# EAGLE design rfid1 (EAGLE 6.0)
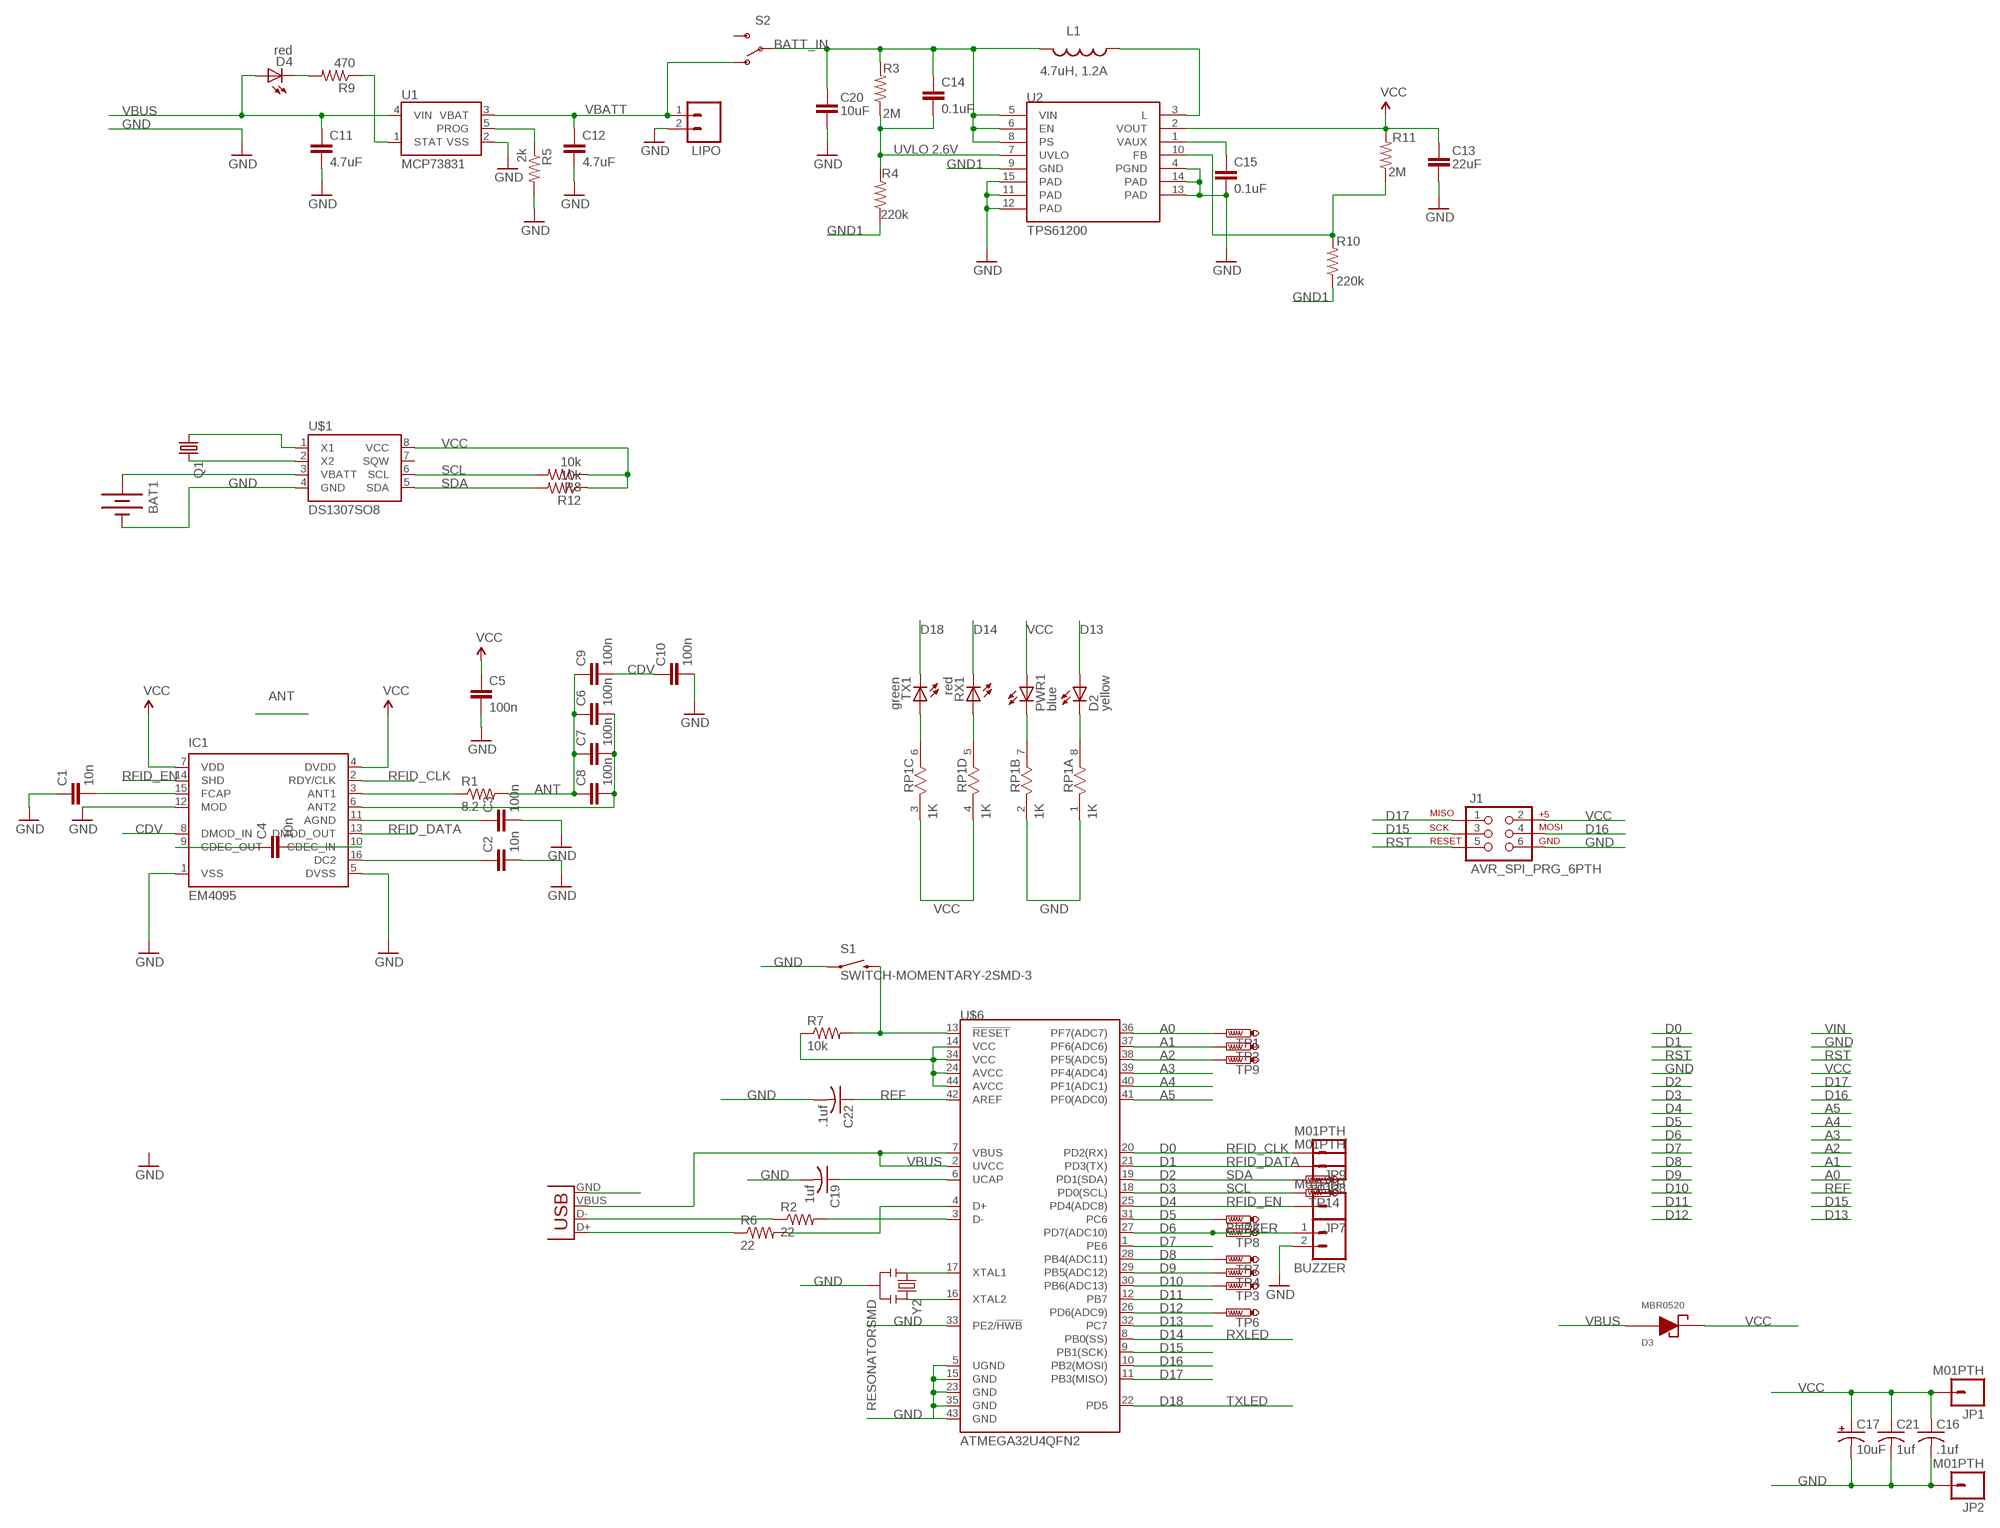
[diagram p0: schematic, sheet 1]

## Parts
BAT1  BATTERY12MM  [BATTCON_12MM]
BUZZER  M02PTH  [1X02]
C1  10n  CAP0805  [0805]
C2  10n  CAP0805  [0805]
C3  100n  CAP0805  [0805]
C4  10n  CAP0805  [0805]
C5  100n  CAP0805  [0805]
C6  100n  CAP0805  [0805]
C7  100n  CAP0805  [0805]
C8  100n  CAP0805  [0805]
C9  100n  CAP0805  [0805]
C10  100n  CAP0805  [0805]
C11  4.7uF  CAP0402-CAP  [0402-CAP]
C12  4.7uF  CAP0402-CAP  [0402-CAP]
C13  22uF  CAP0805  [0805]
C14  0.1uF  CAP0402-CAP  [0402-CAP]
C15  0.1uF  CAP0402-CAP  [0402-CAP]
C16  .1uf  C-USC0603  [C0603]
C17  10uF  CAP_POL1206  [EIA3216]
C19  1uf  C-USC0603  [C0603]
C20  10uF  CAP1206  [1206]
C21  1uf  C-USC0603  [C0603]
C22  .1uf  C-USC0603  [C0603]
D2  yellow  LEDCHIPLED_0805  [CHIPLED_0805]
D3  MBR0520  [SOD-123]
D4  red  LED0603  [LED-0603]
IC1  EM4095  [SO16]
J1  AVR_SPI_PRG_6PTH  [2X3]
JP1  M01PTH  [1X01]
JP2  M01PTH  [1X01]
JP7  M01PTH  [1X01]
JP8  M01PTH  [1X01]
JP9  M01PTH  [1X01]
L1  4.7uH, 1.2A  INDUCTOR.  [CDRH2D09]
LIPO  M02PTH  [1X02]
PWR1  blue  LEDCHIPLED_0805  [CHIPLED_0805]
Q1  CRYSTALTC26H  [TC26H]
R1  8.2  RESISTOR0805-RES  [0805]
R2  22  RESISTOR0603-RES  [0603-RES]
R3  2M  RESISTOR0402-RES  [0402-RES]
R4  220k  RESISTOR0402-RES  [0402-RES]
R5  2k  RESISTOR0402-RES  [0402-RES]
R6  22  RESISTOR0603-RES  [0603-RES]
R7  10k  RESISTOR0603-RES  [0603-RES]
R8  10k  RESISTOR0603-RES  [0603-RES]
R9  470  RESISTOR0402-RES  [0402-RES]
R10  220k  RESISTOR0402-RES  [0402-RES]
R11  2M  RESISTOR0402-RES  [0402-RES]
R12  10k  RESISTOR0603-RES  [0603-RES]
RP1  1K  RES4NT  [RES4NT]
RX1  red  LEDCHIPLED_0805  [CHIPLED_0805]
S1  SWITCH-MOMENTARY-2SMD-3  [TACTILE_SWITCH_SMD-3]
S2  SWITCH-SPDTPTH  [SWITCH-SPDT]
TP1  PTR1TP15R  [TP15R]
TP2  PTR1TP15R  [TP15R]
TP3  PTR1TP15R  [TP15R]
TP4  PTR1TP15R  [TP15R]
TP5  PTR1TP15R  [TP15R]
TP6  PTR1TP15R  [TP15R]
TP7  PTR1TP15R  [TP15R]
TP8  PTR1TP15R  [TP15R]
TP9  PTR1TP15R  [TP15R]
TP13  PTR1TP15R  [TP15R]
TP14  PTR1TP15R  [TP15R]
TX1  green  LEDCHIPLED_0805  [CHIPLED_0805]
U1  MCP73831  [SOT23-5]
U2  TPS61200  [QFN-10_PAD]
U$1  DS1307SO8  [SO08]
U$6  ATMEGA32U4QFN2  [QFN-44-NOPAD]
X2  USB-MICROB  [USB-MICROB]
Y2  RESONATORSMD  [RESONATOR-SMD]

## Nets
A0: TP1.TP U$6.36(PF7(ADC7))
A1: TP2.TP U$6.37(PF6(ADC6))
A2: TP9.TP U$6.38(PF5(ADC5))
A3: U$6.39(PF4(ADC4))
A4: U$6.40(PF1(ADC1))
A5: U$6.41(PF0(ADC0))
ANT: C6.1 C7.1 C8.1 C9.1 R1.2
BATT_IN: C14.1 C20.1 L1.P$2 R3.2 S2.2(P) U2.5(VIN) U2.6(EN) U2.8(PS)
CDV: C9.2 C10.1 IC1.8(DMOD_IN)
D5: TP5.TP U$6.31(PC6)
D6: BUZZER.1 TP8.TP U$6.27(PD7(ADC10))
D7: U$6.1(PE6)
D8: TP7.TP U$6.28(PB4(ADC11))
D9: TP4.TP U$6.29(PB5(ADC12))
D10: TP3.TP U$6.30(PB6(ADC13))
D11: U$6.12(PB7)
D12: TP6.TP U$6.26(PD6(ADC9))
D13: D2.A U$6.32(PC7)
D14: RX1.C U$6.8(PB0(SS))
D15: J1.3 U$6.9(PB1(SCK))
D16: J1.4 U$6.10(PB2(MOSI))
D17: J1.1 U$6.11(PB3(MISO))
D18: TX1.C U$6.22(PD5)
FB: R10.2 R11.1 U2.10(FB)
GND: BAT1.GND(-) BUZZER.2 C1.1 C2.2 C3.2 C5.2 C10.2 C11.2 C12.2 C13.2 C15.2 C16.2 C17.C(-) C19.2 C20.2 C21.2 C22.2 IC1.1(VSS) IC1.5(DVSS) IC1.12(MOD) J1.6 JP2.1 LIPO.2 R5.2 RP1.1 RP1.2 S1.P$1 U1.2(VSS) U2.4(PGND) U2.11(PAD) U2.12(PAD) U2.13(PAD) U2.14(PAD) U2.15(PAD) U$1.4(GND) U$6.5(UGND) U$6.15(GND) U$6.23(GND) U$6.33(PE2/!HWB) U$6.35(GND) U$6.43(GND) X2.GND Y2.2
GND1: R4.1 R10.1 U2.9(GND)
N$1: IC1.3(ANT1) R1.1
N$2: D4.C R9.2
N$3: U$6.16(XTAL2) Y2.3
N$4: C6.2 C7.2 C8.2 IC1.6(ANT2)
N$5: L1.P$1 U2.3(L)
N$6: C3.1 IC1.11(AGND)
N$7: C4.2 IC1.10(CDEC_IN)
N$8: C4.1 IC1.9(CDEC_OUT)
N$9: C15.1 U2.1(VAUX)
N$11: R5.1 U1.5(PROG)
N$12: C2.1 IC1.16(DC2)
N$14: R9.1 U1.1(STAT)
N$15: C1.2 IC1.15(FCAP)
N$17: Q1.1 U$1.1(X1)
N$18: U$6.17(XTAL1) Y2.1
N$19: Q1.2 U$1.2(X2)
N$20: BAT1.PWR@1(+) U$1.3(VBATT)
N$22: R6.2 U$6.4(D+)
N$23: R2.2 U$6.3(D-)
N$24: C19.1 U$6.6(UCAP)
N$25: R2.1 X2.D-
N$26: R6.1 X2.D+
N$28: RP1.6 TX1.A
N$29: RP1.5 RX1.A
N$30: PWR1.C RP1.7
N$31: D2.C RP1.8
REF: C22.1 U$6.42(AREF)
RFID_CLK: IC1.2(RDY/CLK) JP9.1 U$6.20(PD2(RX))
RFID_DATA: IC1.13(DMOD_OUT) JP8.1 U$6.21(PD3(TX))
RFID_EN: IC1.14(SHD) JP7.1 U$6.25(PD4(ADC8))
RST: J1.5 R7.2 S1.P$2 U$6.13(!RESET)
SCL: R8.2 TP14.TP U$1.6(SCL) U$6.18(PD0(SCL))
SDA: R12.2 TP13.TP U$1.5(SDA) U$6.19(PD1(SDA))
UVLO: C14.2 R3.1 R4.2 U2.7(UVLO)
VBATT: C12.1 LIPO.1 S2.1(O) U1.3(VBAT)
VBUS: C11.1 D3.2(AN) D4.A U1.4(VIN) U$6.2(UVCC) U$6.7(VBUS) X2.VBUS
VCC: C5.1 C13.1 C16.1 C17.A(+) C21.1 D3.1(CA) IC1.4(DVDD) IC1.7(VDD) J1.2 JP1.1 PWR1.A R7.1 R8.1 R11.2 R12.1 RP1.3 RP1.4 U2.2(VOUT) U$1.8(VCC) U$6.14(VCC) U$6.24(AVCC) U$6.34(VCC) U$6.44(AVCC)
Unconnected: S2.3(S) U$1.7(SQW)

## Notes on the sheet
- UVLO 2.6V
- D0
- D1
- D2
- D3
- D4
- BUZZER
- RXLED
- TXLED

## Library data of the parts
BAT1 = SparkFun-Electromechanical:BATTERY: Battery Holders Various common sizes : AA, AAA, 20mm coin cell and 12mm coin cell.
BUZZER LIPO = SparkFun-Connectors:M02: Header 2 Standard 2-pin 0.1" header. Use with straight break away headers (SKU : PRT-00116), right angle break away headers (PRT-00553), swiss pins (PRT-00743), machine pins (PRT-00117), and female headers (PRT-00115). Molex polarized connector foot print use with SKU : PRT-08233 with associated crimp pins and housings.
C1-C10 = SparkFun-Passives:CAP: Capacitor Standard 0603 ceramic capacitor, and 0.1" leaded capacitor.
C11 C12 C14 C15 = SparkFun:CAP: Capacitor Standard 0603 ceramic capacitor, and 0.1" leaded capacitor.
C13 C20 = CH_passive:CAP: Capacitor Standard 0603 ceramic capacitor, and 0.1" leaded capacitor.
C16 C19 C21 C22 = resistor:C-US: CAPACITOR, American symbol
C17 = SparkFun:CAP_POL: Capacitor Polarized These are standard SMD and PTH capacitors. Normally 10uF, 47uF, and 100uF in electrolytic and tantalum varieties. Always verify the external diameter of the through hole cap, it varies with capacity, voltage, and manufacturer. The EIA devices should be standard.
D2 PWR1 RX1 TX1 = led:LED: LED OSRAM: - CHIPLED LG R971, LG N971, LY N971, LG Q971, LY Q971, LO R971, LY R971 LH N974, LH R974 LS Q976, LO Q976, LY Q976 LO Q996 - Hyper CHIPLED LW Q18S LB Q993, LB Q99A, LB R99A - SideLED LS A670, LO A670, LY A670, LG A670, LP A670 LB A673, LV A673, LT A673, LW A673 LH A674 LY A675 LS A676, LA A676, LO A676, LY A676, LW A676 LS A679, LY A679, LG A679 - Hyper Micro SIDELED® LS Y876, LA Y876, LO Y876, LY Y876 LT Y87S - SmartLED LW L88C, LW L88S LB L89C, LB L89S, LG L890 LS L89K, LO L89K, LY L89K LS L896, LA L896, LO L896, LY L896 - TOPLED LS T670, LO T670, LY T670, LG T670, LP T670 LSG T670, LSP T670, LSY T670, LOP T670, LYG T670 LG T671, LOG T671, LSG T671 LB T673, LV T673, LT T673, LW T673 LH T674 LS T676, LA T676, LO T676, LY T676, LB T676, LH T676, LSB T676, LW T676 LB T67C, LV T67C, LT T67C, LS T67K, LO T67K, LY T67K, LW E67C LS E67B, LA E67B, LO E67B, LY E67B, LB E67C, LV E67C, LT E67C LW T67C LS T679, LY T679, LG T679 LS T770, LO T770, LY T770, LG T770, LP T770 LB T773, LV T773, LT T773, LW T773 LH T774 LS E675, LA E675, LY E675, LS T675 LS T776, LA T776, LO T776, LY T776, LB T776 LHGB T686 LT T68C, LB T68C - Hyper Mini TOPLED® LB M676 - Mini TOPLED Santana® LG M470 LS M47K, LO M47K, LY M47K Source: http://www.osram.convergy.de LUXEON: - LUMILED® LXK2-PW12-R00, LXK2-PW12-S00, LXK2-PW14-U00, LXK2-PW14-V00 LXK2-PM12-R00, LXK2-PM12-S00, LXK2-PM14-U00 LXK2-PE12-Q00, LXK2-PE12-R00, LXK2-PE12-S00, LXK2-PE14-T00, LXK2-PE14-U00 LXK2-PB12-K00, LXK2-PB12-L00, LXK2-PB12-M00, LXK2-PB14-N00, LXK2-PB14-P00, LXK2-PB14-Q00 LXK2-PR12-L00, LXK2-PR12-M00, LXK2-PR14-Q00, LXK2-PR14-R00 LXK2-PD12-Q00, LXK2-PD12-R00, LXK2-PD12-S00 LXK2-PH12-R00, LXK2-PH12-S00 LXK2-PL12-P00, LXK2-PL12-Q00, LXK2-PL12-R00 Source: www.luxeon.com KINGBRIGHT: KA-3528ASYC Source: www.kingbright.com
D3 = MySMD:MBR0520
D4 = SparkFun:LED: LEDs Standard schematic elements and footprints for 5mm, 3mm, 1206, and 0603 sized LEDs. 5mm - Spark Fun Electronics SKU : COM-00529 (and others)
IC1 = em-microelectronic:EM4095: Read/Write analog front end for 125kHz RFID Basestation Source: http://www.emmicroelectronic.com/webfiles/Product/RFID/DS/EM4095_DS.pdf
J1 = SparkFun-Connectors:AVR_SPI_PRG_6: AVR ISP 6 Pin This is the reduced ISP connector for AVR programming. Common on Arduino. This footprint will take up less PCB space and can be used with a 10-pin to 6-pin adapter such as SKU: BOB-08508
JP1 JP2 JP7-JP9 = SparkFun-Connectors:M01: Header 1 Standard 1-pin 0.1" header. Use with straight break away headers (SKU : PRT-00116), right angle break away headers (PRT-00553), swiss pins (PRT-00743), machine pins (PRT-00117), and female headers (PRT-00115).
L1 = SparkFun:INDUCTOR: Inductors Basic Inductor/Choke - 0603 and 1206. Footprints are not proven and vary greatly between part numbers.
Q1 = crystal:CRYSTAL: CRYSTAL; OC_FARNELL: unknown; OC_NEWARK: unknown
R1 = SparkFun-Passives:RESISTOR: Resistor Basic schematic elements and footprints for 0603, 1206, and PTH resistors.
R2-R12 = SparkFun:RESISTOR: Resistor Basic schematic elements and footprints for 0603, 1206, and PTH resistors.
RP1 = MySMD:RES4NT
S1 = SparkFun:SWITCH-MOMENTARY-2
S2 = SparkFun-Electromechanical:SWITCH-SPDT: SPST Switch Simple slide switch. Spark Fun Electronics SKU : COM-00102
TP1-TP9 TP13 TP14 = testpad:PTR1: TEST PIN
U1 = SparkFun:MCP73831: Microchip's MCP73831 Miniature single cell, fully integrated Li-Ion, Li-polymer charge management controller http://ww1.microchip.com/downloads/en/DeviceDoc/21984a.pdf
U2 = SparkFun:TPS61200: DC to DC Booster
U$1 = SparkFun-FreqCtrl:DS1307: I2C real-time clock with battery backup.
U$6 = SparkFun-DigitalIC:ATMEGA32U4: Atmel 44-pin 8-bit Microcontroller with 32KBytes of ISP Flash and USB Controller
X2 = SparkFun:USB: USB Connectors USB-B-PTH is fully proven SKU : PRT-00139 USB-miniB is fully proven SKU : PRT-00587 USB-A-PCB is untested. USB-A-H is throughly reviewed, but untested. Spark Fun Electronics SKU : PRT-00437 USB-B-SMT is throughly reviewed, but untested. Needs silkscreen touching up. USB-A-S has not been used/tested USB-MB-H has not been used/tested
Y2 = SparkFun:RESONATOR: Resonator Small SMD resonator. This is the itty bitty 10/20MHz resonators with built in caps. CSTCE10M0G55 and CSTCE20M0V53. Footprint has been reviewed closely but hasn't been tested yet.

## Board
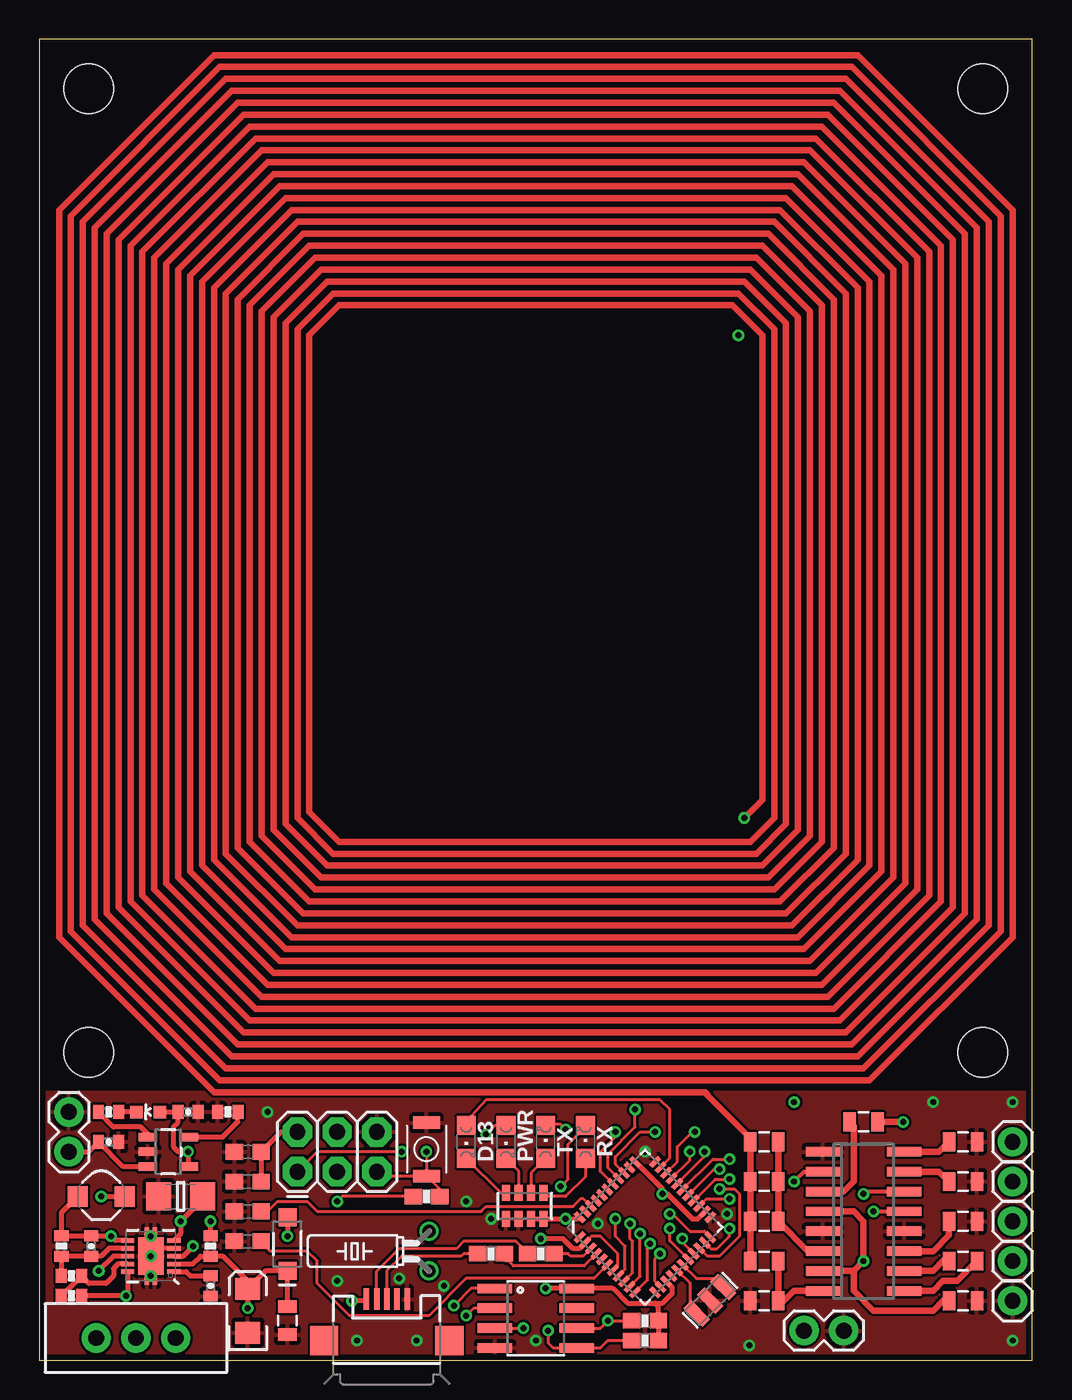
[diagram p1: board, top side]
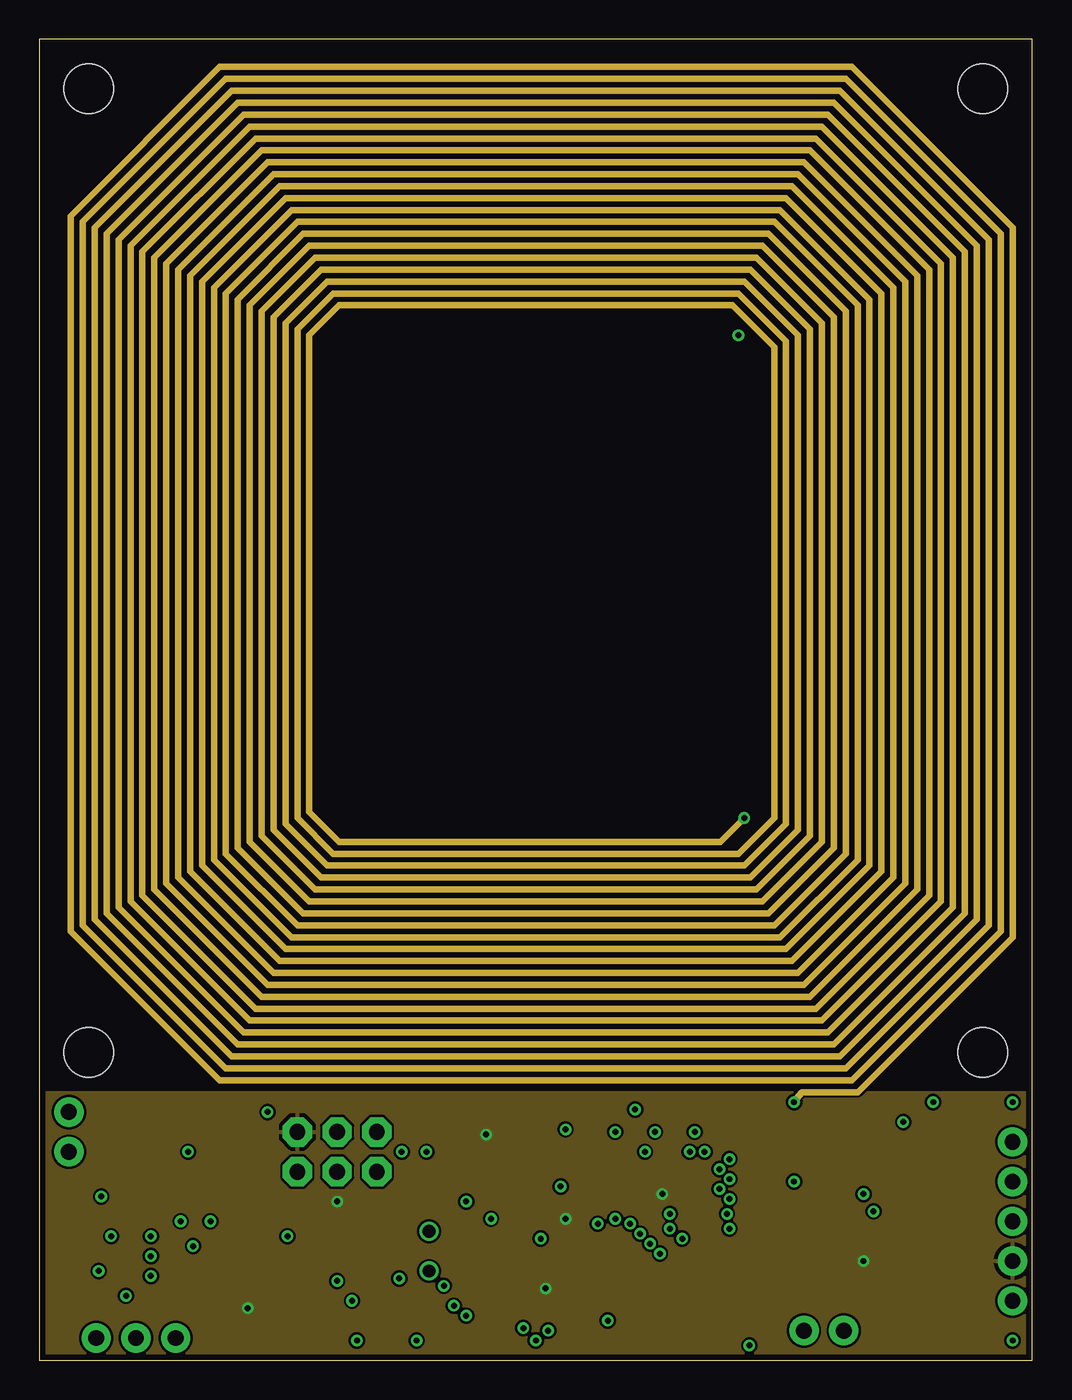
[diagram p2: board, inner layer Route2]
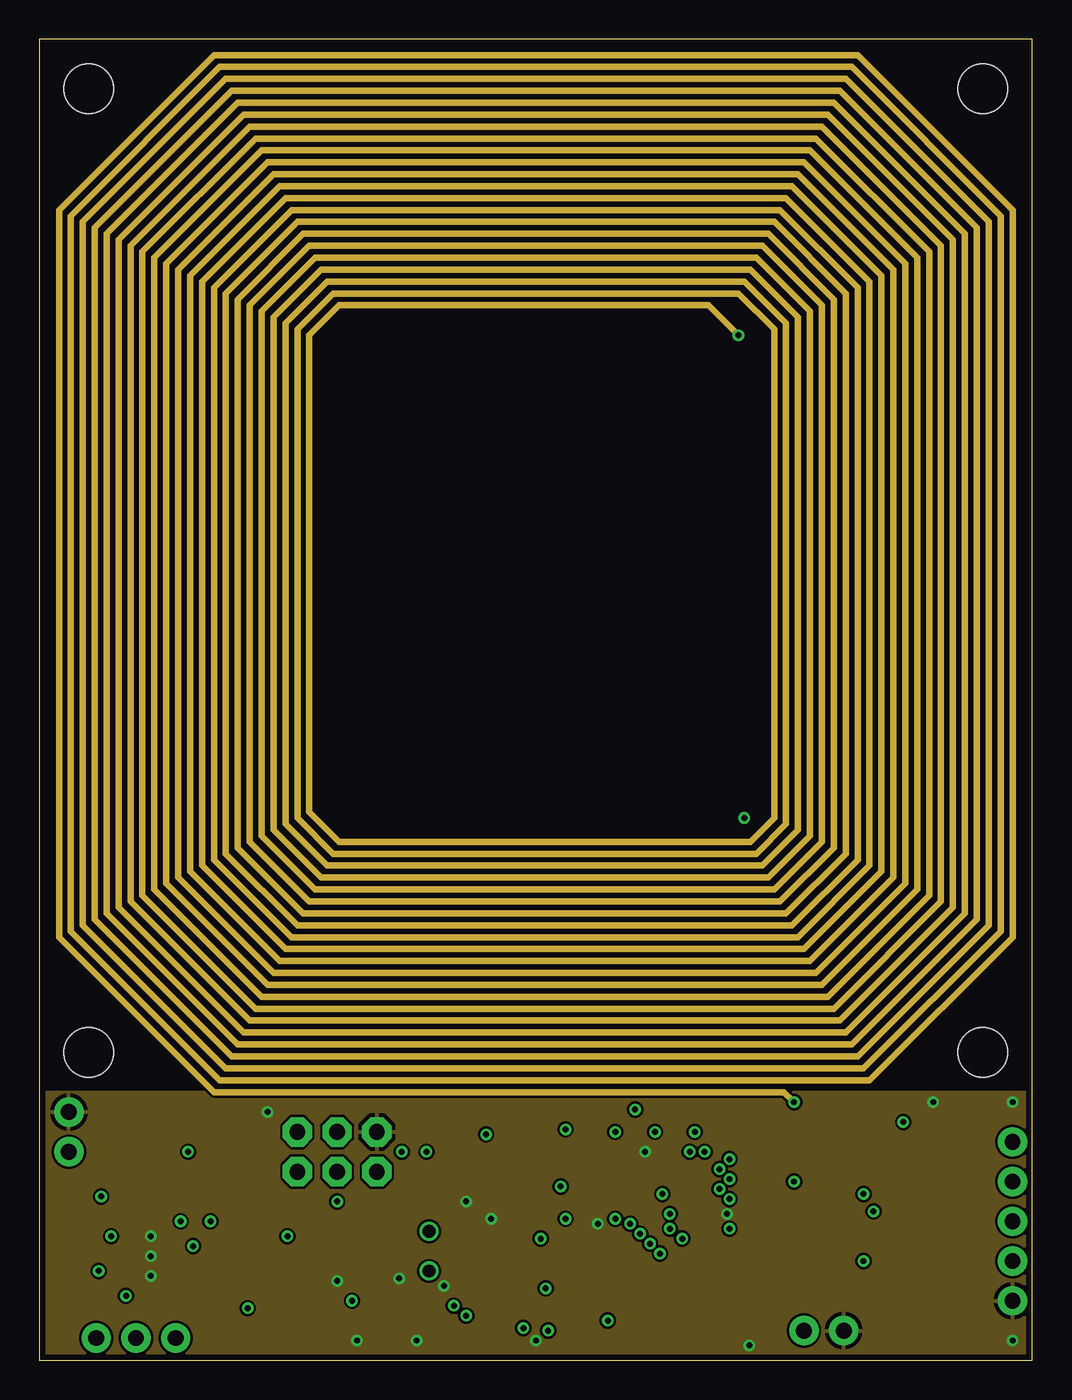
[diagram p3: board, inner layer Route15]
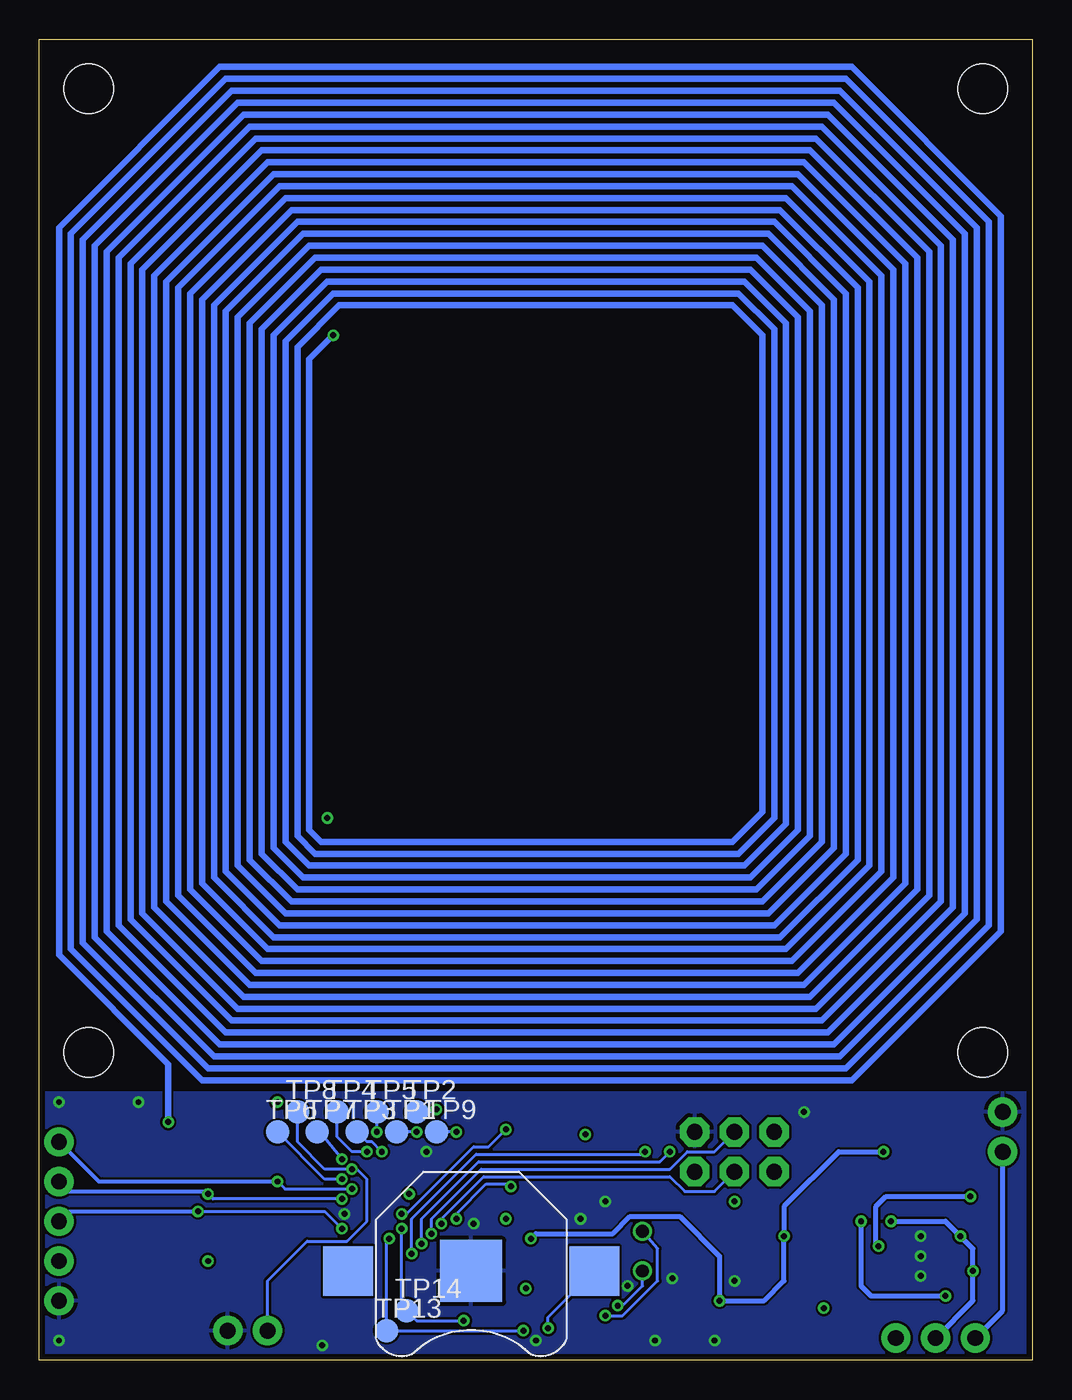
[diagram p4: board, bottom side, seen from below]

Size 63.5 x 84.45 mm. Coordinates in mm from the lower left corner, seen from the top.
Outline: 0,0 63.5,0 63.5,84.45 0,84.45 0,0
Copper layers (1*16): Top 0.0356mm / dielectric 1.5011mm / Bottom 0.0356mm
Design rules: minimum track width 6mil, minimum drill 13mil, track to track 6mil, track to pad 6mil, pad to pad 6mil, via to via 6mil, smd to smd 6mil, copper to edge 15mil, drill to drill 6mil, minimum pad ring 7mil, minimum via ring 7mil, stop-mask expansion 4mil, vias tented up to drill 16mil, thermal gap 10mil
Holes 3.17 mm at 3.17,81.28 60.33,81.28 60.33,19.69 3.17,19.69

### Footprints (pad centres in the part's own frame; a part is rotated, then mirrored left to right if it is on the bottom)
BATTCON_12MM = smd 3.962 x 3.962: GND 0,0 | smd 3.175 x 3.175: PWR@1 -7.874,0; PWR@2 7.874,0
1X02 = drill 1.016 pad 1.88: 1 0,0; 2 2.54,0
0805 = smd 0.8 x 1.2: 1 -0.9,0; 2 0.9,0
0402-CAP = smd 0.7 x 0.9: 1 -0.65,0; 2 0.65,0
C0603 = smd 1.1 x 1: 1 -0.85,0; 2 0.85,0
EIA3216 = smd 1.4 x 1.6: A 1.4,0; C -1.4,0
1206 = smd 1.6 x 1.8: 1 -1.4,0; 2 1.4,0
CHIPLED_0805 = smd 1.2 x 1.2: A 0,-1.05; C 0,1.05
SOD-123 = smd 1.143 x 1.143: 1 0,0; 2 3.429,0
LED-0603 = smd 0.8 x 0.8: A 0,-0.75; C 0,0.75
SO16 = smd 0.6 x 2.2: 1 -4.445,-2.6; 2 -3.175,-2.6; 3 -1.905,-2.6; 4 -0.635,-2.6; 5 0.635,-2.6; 6 1.905,-2.6; 7 3.175,-2.6; 8 4.445,-2.6; 9 4.445,2.6; 10 3.175,2.6; 11 1.905,2.6; 12 0.635,2.6; 13 -0.635,2.6; 14 -1.905,2.6; 15 -3.175,2.6; 16 -4.445,2.6
2X3 = drill 1.016 pad 1.88 octagon: 1 0,0; 2 0,2.54; 3 2.54,0; 4 2.54,2.54; 5 5.08,0; 6 5.08,2.54
1X01 = drill 1.016 pad 1.88: 1 0,0
CDRH2D09 = smd 1.3 x 1.3: P$1 -1.5,0; P$2 1.5,0
TC26H = drill 0.813: 1 -1.27,0; 2 1.27,0
0603-RES = smd 1.1 x 1: 1 -0.85,0; 2 0.85,0
0402-RES = smd 0.7 x 0.9: 1 -0.65,0; 2 0.65,0
RES4NT = smd 0.508 x 1.016: 1 0,0; 2 0.8,0; 3 1.6,0; 4 2.4,0; 5 2.4,1.651; 6 1.6,1.651; 7 0.8,1.651; 8 0,1.651
TACTILE_SWITCH_SMD-3 = smd 0.8 x 1.7: P$1 -1.7,0; P$2 1.7,0
SWITCH-SPDT = drill 1.016 pad 1.88: 1 0,2.54; 2 0,0; 3 0,-2.54
TP15R = smd 1.5 x 1.5: TP 0,0
SOT23-5 = smd 0.55 x 1.2: 1 -0.95,-1.3; 2 0,-1.3; 3 0.95,-1.3; 4 0.95,1.3; 5 -0.95,1.3
QFN-10_PAD = smd 0.297 x 0.85: 1 -1,-1.475; 2 -0.5,-1.475; 3 0,-1.475; 4 0.5,-1.475; 5 1,-1.475; 6 1,1.475; 7 0.5,1.475; 8 0,1.475; 9 -0.5,1.475; 10 -1,1.475 | smd 0.7 x 0.28: 11 -1.5,0.25; 12 -1.5,-0.25; 13 1.5,0.25; 14 1.5,-0.25 | smd 2.4 x 1.65: 15 0,0
SO08 = smd 0.61 x 2.21: 1 -1.905,-2.616; 2 -0.635,-2.616; 3 0.635,-2.616; 4 1.905,-2.616; 5 1.905,2.616; 6 0.635,2.616; 7 -0.635,2.616; 8 -1.905,2.616
QFN-44-NOPAD = smd 0.8 x 0.3: 1 -3.4,2.5; 2 -3.4,2; 3 -3.4,1.5; 4 -3.4,1; 5 -3.4,0.5; 6 -3.4,0; 7 -3.4,-0.5; 8 -3.4,-1; 9 -3.4,-1.5; 10 -3.4,-2; 11 -3.4,-2.5; 23 3.4,-2.5; 24 3.4,-2; 25 3.4,-1.5; 26 3.4,-1; 27 3.4,-0.5; 28 3.4,0; 29 3.4,0.5; 30 3.4,1; 31 3.4,1.5; 32 3.4,2; 33 3.4,2.5 | smd 0.3 x 0.8: 12 -2.5,-3.4; 13 -2,-3.4; 14 -1.5,-3.4; 15 -1,-3.4; 16 -0.5,-3.4; 17 0,-3.4; 18 0.5,-3.4; 19 1,-3.4; 20 1.5,-3.4; 21 2,-3.4; 22 2.5,-3.4; 34 2.5,3.4; 35 2,3.4; 36 1.5,3.4; 37 1,3.4; 38 0.5,3.4; 39 0,3.4; 40 -0.5,3.4; 41 -1,3.4; 42 -1.5,3.4; 43 -2,3.4; 44 -2.5,3.4
USB-MICROB = smd 0.35 x 1.4: D+ 0,2.65; D- -0.65,2.65; GND 1.3,2.65; ID 0.65,2.65; VBUS -1.3,2.65 | smd 1.8 x 1.9: MT1 -4,0; MT2 4,0
RESONATOR-SMD = smd 0.7 x 1.7: 1 -1.2,0; 2 0,0; 3 1.2,0

### Placement (x,y rotation side)
BAT1  35.88,5.71 180 bottom
BUZZER  48.9,1.91 0 top
C1  59.05,11.43 180 top
C2  59.05,13.97 0 top
C3  59.05,8.89 0 top
C4  59.05,6.35 180 top
C5  59.05,3.81 0 top
C6  46.35,13.97 0 top
C7  46.35,11.43 0 top
C8  46.35,8.89 0 top
C9  46.35,6.35 0 top
C10  46.35,3.81 180 top
C11  9.53,15.88 0 top
C12  4.45,13.97 0 top
C13  15.88,2.54 270 top
C14  3.33,7.3 270 top
C15  10.95,4.76 270 top
C16  13.34,11.43 180 top
C17  13.34,3.17 90 top
C19  13.34,7.62 180 top
C20  9.05,10.48 180 top
C21  13.34,13.33 180 top
C22  13.34,9.53 180 top
D2  27.3,13.97 180 top
D3  15.88,5.71 90 top
D4  6.99,15.88 90 top
IC1  52.7,8.89 270 top
J1  16.51,12.06 0 top
JP1  62.23,6.35 0 top
JP2  62.23,3.81 0 top
JP7  62.23,11.43 0 top
JP8  62.23,8.89 0 top
JP9  62.23,13.97 0 top
L1  3.97,10.48 180 top
LIPO  1.91,13.33 90 top
PWR1  29.84,13.97 180 top
Q1  24.92,6.98 90 top
R1  52.7,15.24 0 top
R2  32.07,6.83 0 top
R3  1.43,7.3 90 top
R4  2.06,5.4 180 top
R5  12.06,15.88 180 top
R6  28.89,6.83 0 top
R7  24.77,10.48 0 top
R8  38.73,2.54 180 top
R9  4.45,15.88 0 top
R10  2.06,4.13 0 top
R11  10.95,7.3 270 top
R12  38.73,1.27 180 top
RP1  29.84,9.05 0 top
RX1  34.92,13.97 0 top
S1  24.77,13.49 270 top
S2  6.19,1.43 90 top
TP1  40.64,14.61 0 bottom
TP2  39.37,15.88 0 bottom
TP3  43.18,14.61 0 bottom
TP4  44.45,15.88 0 bottom
TP5  41.91,15.88 0 bottom
TP6  48.26,14.61 0 bottom
TP7  45.72,14.61 0 bottom
TP8  46.99,15.88 0 bottom
TP9  38.1,14.61 0 bottom
TP13  41.27,1.91 0 bottom
TP14  40.01,3.17 0 bottom
TX1  32.38,13.97 0 top
U1  8.26,13.33 270 top
U2  7.14,6.67 90 top
U$1  31.75,2.7 270 top
U$6  38.73,8.52 45 top
X2  22.23,1.27 0 top
Y2  42.89,3.84 225 top

### Tracks (layer width: path | path; a pad name or v marks a point on that pad's centre or on a via)
A0  (via drill 0.38)
  Top 0.203: U$6.36 36.83,12.54 36.83,13.02 38.42,14.61 v39.37,14.61
  Bottom 0.203: v39.37,14.61 TP1.TP
A1  (via drill 0.38)
  Top 0.203: U$6.37 36.35,12.31 36.35,13.18 38.1,14.92 v38.1,16.03
  Bottom 0.203: v38.1,16.03 38.26,15.88 TP2.TP
A2  (via drill 0.38)
  Top 0.203: U$6.38 35.88,12.08 35.88,13.33 36.83,14.29 v36.83,14.61
  Bottom 0.203: v36.83,14.61 TP9.TP
ANT  (via drill 0.38)
  Top 0.406: v45.09,34.67 46.23,35.81 46.23,65.53 44.32,67.44 19.18,67.44 17.27,65.53 17.27,35.05 19.18,33.15 45.47,33.15 46.99,34.67 46.99,65.91 44.7,68.2 18.8,68.2 16.51,65.91 16.51,34.67 18.8,32.38 45.85,32.38 47.75,34.29 47.75,66.29 45.09,68.96 18.41,68.96 15.75,66.29 15.75,34.29 18.41,31.62 46.23,31.62 48.51,33.91 48.51,66.68 45.47,69.72 18.03,69.72 14.99,66.68 14.99,33.91 18.03,30.86 46.61,30.86 49.28,33.53 49.28,67.06 45.85,70.48 17.65,70.48 14.22,67.06 14.22,33.53 17.65,30.1 46.99,30.1 50.04,33.15 50.04,67.44 46.23,71.25 17.27,71.25 13.46,67.44 13.46,33.15 17.27,29.34 47.37,29.34 50.8,32.77 50.8,67.82 46.61,72.01 16.89,72.01 12.7,67.82 12.7,32.77 16.89,28.58 47.75,28.58 51.56,32.38 51.56,68.2 46.99,72.77 16.51,72.77 11.94,68.2 11.94,32.38 16.51,27.81 48.13,27.81 52.32,32 52.32,68.58 47.37,73.53 16.13,73.53 11.18,68.58 11.18,32 16.13,27.05 48.51,27.05 53.09,31.62 53.09,68.96 47.75,74.3 15.75,74.3 10.41,68.96 10.41,31.62 15.75,26.29 48.9,26.29 53.85,31.24 53.85,69.34 48.13,75.06 15.37,75.06 9.65,69.34 9.65,31.24 15.37,25.53 49.28,25.53 54.61,30.86 54.61,69.72 48.51,75.82 14.99,75.82 8.89,69.72 8.89,30.86 14.99,24.77 49.66,24.77 55.37,30.48 55.37,70.1 48.9,76.58 14.61,76.58 8.13,70.1 8.13,30.48 14.61,24 50.04,24 56.13,30.1 56.13,70.48 49.28,77.34 14.22,77.34 7.37,70.48 7.37,30.1 14.22,23.24 50.42,23.24 56.9,29.72 56.9,70.87 49.66,78.11 13.84,78.11 6.6,70.87 6.6,29.72 13.84,22.48 50.8,22.48 57.66,29.34 57.66,71.25 50.04,78.87 13.46,78.87 5.84,71.25 5.84,29.34 13.46,21.72 51.18,21.72 58.42,28.96 58.42,71.63 50.42,79.63 13.08,79.63 5.08,71.63 5.08,28.96 13.08,20.96 51.56,20.96 59.18,28.58 59.18,72.01 50.8,80.39 12.7,80.39 4.32,72.01 4.32,28.58 12.7,20.19 51.94,20.19 59.94,28.19 59.94,72.39 51.18,81.15 12.32,81.15 3.56,72.39 3.56,28.19 12.32,19.43 52.32,19.43 60.71,27.81 60.71,72.77 51.56,81.92 11.94,81.92 2.79,72.77 2.79,27.81 11.94,18.67 52.7,18.67 61.47,27.43 61.47,73.15 51.94,82.68 11.56,82.68 2.03,73.15 2.03,27.43 11.56,17.91 53.09,17.91 62.23,27.05 62.23,73.53 52.32,83.44 11.18,83.44 1.27,73.53 1.27,27.05 11.18,17.15 42.61,17.15 42.74,17.02 42.67,17.02 45.58,14.11 45.59,14.11 C6.1 C7.1 C8.1 C9.1
  Top 0.406: R1.2 v55.24,15.24
  Route2 0.406: v45.09,34.67 43.56,33.15 19.18,33.15 17.27,35.05 17.27,65.53 19.18,67.44 44.32,67.44 46.99,64.77 46.99,34.67 44.7,32.38 18.8,32.38 16.51,34.67 16.51,65.91 18.8,68.2 44.7,68.2 47.75,65.15 47.75,34.29 45.09,31.62 18.41,31.62 15.75,34.29 15.75,66.29 18.41,68.96 45.09,68.96 48.51,65.53 48.51,33.91 45.47,30.86 18.03,30.86 14.99,33.91 14.99,66.68 18.03,69.72 45.47,69.72 49.28,65.91 49.28,33.53 45.85,30.1 17.65,30.1 14.22,33.53 14.22,67.06 17.65,70.48 45.85,70.48 50.04,66.29 50.04,33.15 46.23,29.34 17.27,29.34 13.46,33.15 13.46,67.44 17.27,71.25 46.23,71.25 50.8,66.68 50.8,32.77 46.61,28.58 16.89,28.58 12.7,32.77 12.7,67.82 16.89,72.01 46.61,72.01 51.56,67.06 51.56,32.38 46.99,27.81 16.51,27.81 11.94,32.38 11.94,68.2 16.51,72.77 46.99,72.77 52.32,67.44 52.32,32 47.37,27.05 16.13,27.05 11.18,32 11.18,68.58 16.13,73.53 47.37,73.53 53.09,67.82 53.09,31.62 47.75,26.29 15.75,26.29 10.41,31.62 10.41,68.96 15.75,74.3 47.75,74.3 53.85,68.2 53.85,31.24 48.13,25.53 15.37,25.53 9.65,31.24 9.65,69.34 15.37,75.06 48.13,75.06 54.61,68.58 54.61,30.86 48.51,24.77 14.99,24.77 8.89,30.86 8.89,69.72 14.99,75.82 48.51,75.82 55.37,68.96 55.37,30.48 48.9,24 14.61,24 8.13,30.48 8.13,70.1 14.61,76.58 48.9,76.58 56.13,69.34 56.13,30.1 49.28,23.24 14.22,23.24 7.37,30.1 7.37,70.48 14.22,77.34 49.28,77.34 56.9,69.72 56.9,29.72 49.66,22.48 13.84,22.48 6.6,29.72 6.6,70.87 13.84,78.11 49.66,78.11 57.66,70.1 57.66,29.34 50.04,21.72 13.46,21.72 5.84,29.34 5.84,71.25 13.46,78.87 50.04,78.87 58.42,70.48 58.42,28.96 50.42,20.96 13.08,20.96 5.08,28.96 5.08,71.63 13.08,79.63 50.42,79.63 59.18,70.87 59.18,28.58 50.8,20.19 12.7,20.19 4.32,28.58 4.32,72.01 12.7,80.39 50.8,80.39 59.94,71.25 59.94,28.19 51.18,19.43 12.32,19.43 3.56,28.19 3.56,72.39 12.32,81.15 51.18,81.15 60.71,71.63 60.71,27.81 51.56,18.67 11.94,18.67 2.79,27.81 2.79,72.77 11.94,81.92 51.56,81.92 61.47,72.01 61.47,27.43 51.94,17.91 11.56,17.91 2.03,27.43 2.03,73.15 11.56,82.68 51.94,82.68 62.23,72.39 62.23,27.05 52.32,17.15 48.77,17.15 v48.26,16.51
  Route15 0.406: v44.7,65.53 42.8,67.44 19.18,67.44 17.27,65.53 17.27,35.05 19.18,33.15 45.47,33.15 46.99,34.67 46.99,65.91 44.7,68.2 18.8,68.2 16.51,65.91 16.51,34.67 18.8,32.38 45.85,32.38 47.75,34.29 47.75,66.29 45.09,68.96 18.41,68.96 15.75,66.29 15.75,34.29 18.41,31.62 46.23,31.62 48.51,33.91 48.51,66.68 45.47,69.72 18.03,69.72 14.99,66.68 14.99,33.91 18.03,30.86 46.61,30.86 49.28,33.53 49.28,67.06 45.85,70.48 17.65,70.48 14.22,67.06 14.22,33.53 17.65,30.1 46.99,30.1 50.04,33.15 50.04,67.44 46.23,71.25 17.27,71.25 13.46,67.44 13.46,33.15 17.27,29.34 47.37,29.34 50.8,32.77 50.8,67.82 46.61,72.01 16.89,72.01 12.7,67.82 12.7,32.77 16.89,28.58 47.75,28.58 51.56,32.38 51.56,68.2 46.99,72.77 16.51,72.77 11.94,68.2 11.94,32.38 16.51,27.81 48.13,27.81 52.32,32 52.32,68.58 47.37,73.53 16.13,73.53 11.18,68.58 11.18,32 16.13,27.05 48.51,27.05 53.09,31.62 53.09,68.96 47.75,74.3 15.75,74.3 10.41,68.96 10.41,31.62 15.75,26.29 48.9,26.29 53.85,31.24 53.85,69.34 48.13,75.06 15.37,75.06 9.65,69.34 9.65,31.24 15.37,25.53 49.28,25.53 54.61,30.86 54.61,69.72 48.51,75.82 14.99,75.82 8.89,69.72 8.89,30.86 14.99,24.77 49.66,24.77 55.37,30.48 55.37,70.1 48.9,76.58 14.61,76.58 8.13,70.1 8.13,30.48 14.61,24 50.04,24 56.13,30.1 56.13,70.48 49.28,77.34 14.22,77.34 7.37,70.48 7.37,30.1 14.22,23.24 50.42,23.24 56.9,29.72 56.9,70.87 49.66,78.11 13.84,78.11 6.6,70.87 6.6,29.72 13.84,22.48 50.8,22.48 57.66,29.34 57.66,71.25 50.04,78.87 13.46,78.87 5.84,71.25 5.84,29.34 13.46,21.72 51.18,21.72 58.42,28.96 58.42,71.63 50.42,79.63 13.08,79.63 5.08,71.63 5.08,28.96 13.08,20.96 51.56,20.96 59.18,28.58 59.18,72.01 50.8,80.39 12.7,80.39 4.32,72.01 4.32,28.58 12.7,20.19 51.94,20.19 59.94,28.19 59.94,72.39 51.18,81.15 12.32,81.15 3.56,72.39 3.56,28.19 12.32,19.43 52.32,19.43 60.71,27.81 60.71,72.77 51.56,81.92 11.94,81.92 2.79,72.77 2.79,27.81 11.94,18.67 52.7,18.67 61.47,27.43 61.47,73.15 51.94,82.68 11.56,82.68 2.03,73.15 2.03,27.43 11.56,17.91 53.09,17.91 62.23,27.05 62.23,73.53 52.32,83.44 11.18,83.44 1.27,73.53 1.27,27.05 11.18,17.15 47.62,17.15 v48.26,16.51
  Bottom 0.406: v44.7,65.53 46.23,64.01 46.23,33.91 45.47,33.15 19.18,33.15 17.27,35.05 17.27,65.53 19.18,67.44 44.32,67.44 46.99,64.77 46.99,33.53 45.85,32.38 18.8,32.38 16.51,34.67 16.51,65.91 18.8,68.2 44.7,68.2 47.75,65.15 47.75,33.15 46.23,31.62 18.41,31.62 15.75,34.29 15.75,66.29 18.41,68.96 45.09,68.96 48.51,65.53 48.51,32.77 46.61,30.86 18.03,30.86 14.99,33.91 14.99,66.68 18.03,69.72 45.47,69.72 49.28,65.91 49.28,32.38 46.99,30.1 17.65,30.1 14.22,33.53 14.22,67.06 17.65,70.48 45.85,70.48 50.04,66.29 50.04,32 47.37,29.34 17.27,29.34 13.46,33.15 13.46,67.44 17.27,71.25 46.23,71.25 50.8,66.68 50.8,31.62 47.75,28.58 16.89,28.58 12.7,32.77 12.7,67.82 16.89,72.01 46.61,72.01 51.56,67.06 51.56,31.24 48.13,27.81 16.51,27.81 11.94,32.38 11.94,68.2 16.51,72.77 46.99,72.77 52.32,67.44 52.32,30.86 48.51,27.05 16.13,27.05 11.18,32 11.18,68.58 16.13,73.53 47.37,73.53 53.09,67.82 53.09,30.48 48.9,26.29 15.75,26.29 10.41,31.62 10.41,68.96 15.75,74.3 47.75,74.3 53.85,68.2 53.85,30.1 49.28,25.53 15.37,25.53 9.65,31.24 9.65,69.34 15.37,75.06 48.13,75.06 54.61,68.58 54.61,29.72 49.66,24.77 14.99,24.77 8.89,30.86 8.89,69.72 14.99,75.82 48.51,75.82 55.37,68.96 55.37,29.34 50.04,24 14.61,24 8.13,30.48 8.13,70.1 14.61,76.58 48.9,76.58 56.13,69.34 56.13,28.96 50.42,23.24 14.22,23.24 7.37,30.1 7.37,70.48 14.22,77.34 49.28,77.34 56.9,69.72 56.9,28.58 50.8,22.48 13.84,22.48 6.6,29.72 6.6,70.87 13.84,78.11 49.66,78.11 57.66,70.1 57.66,28.19 51.18,21.72 13.46,21.72 5.84,29.34 5.84,71.25 13.46,78.87 50.04,78.87 58.42,70.48 58.42,27.81 51.56,20.96 13.08,20.96 5.08,28.96 5.08,71.63 13.08,79.63 50.42,79.63 59.18,70.87 59.18,27.43 51.94,20.19 12.7,20.19 4.32,28.58 4.32,72.01 12.7,80.39 50.8,80.39 59.94,71.25 59.94,27.05 52.32,19.43 12.32,19.43 3.56,28.19 3.56,72.39 12.32,81.15 51.18,81.15 60.71,71.63 60.71,26.67 52.7,18.67 11.94,18.67 2.79,27.81 2.79,72.77 11.94,81.92 51.56,81.92 61.47,72.01 61.47,26.29 53.09,17.91 11.56,17.91 2.03,27.43 2.03,73.15 11.56,82.68 51.94,82.68 62.23,72.39 62.23,25.91 55.24,18.92 v55.24,15.24
BATT_IN  (via drill 0.38)
  Top 0.203: C14.1 3.35,7.94 3.33,7.94 | C20.1 10.45,10.29
  Top 0.305: C14.1 R3.2 1.43,9.44 L1.P$2 | U2.8 4.76,6.67 v3.81,5.71 | 3.35,7.94 v4.6,7.94 4.87,7.67 U2.6 | 10.45,10.29 v9.05,8.89 9.05,8.1 U2.5
  Bottom 0.305: v9.05,8.89 5.56,8.89 v4.6,7.94 3.81,7.14 v3.81,5.71 3.81,3.81 S2.2
CDV
  Top 0.406: 47.38,3.94 C10.1 | C9.2 C10.1 | IC1.8 48.26,4.45 47.62,3.81 C10.1
D5  (via drill 0.38)
  Top 0.203: U$6.31 40.8,12.7 40.8,13.65 41.75,14.61 v41.91,14.61
  Bottom 0.203: v41.91,14.61 TP5.TP
D6  (via drill 0.38)
  Top 0.203: U$6.27 43.15,12.22 v43.5,12.22
  Bottom 0.203: TP8.TP 46.99,13.97 45.24,12.22 v43.5,12.22 43.18,12.22 42.55,11.59 42.55,8.89 43.81,7.62 46.35,7.62 48.9,5.08 BUZZER.1
D8  (via drill 0.38)
  Top 0.203: U$6.28 43.08,12.86 v44.13,12.86
  Bottom 0.203: v44.13,12.86 45.56,14.61 TP7.TP
D9  (via drill 0.38)
  Top 0.203: U$6.29 42.55,13.04 v42.55,13.33
  Bottom 0.203: v42.55,13.33 43.5,13.33 44.45,14.29 TP4.TP
D10  (via drill 0.38)
  Top 0.203: U$6.30 41.59,12.79 v41.59,13.33
  Bottom 0.203: v41.59,13.33 42.23,13.97 42.55,13.97 TP3.TP
D12  (via drill 0.38)
  Top 0.203: U$6.26 43.22,11.59 v44.13,11.59
  Bottom 0.203: v44.13,11.59 45.24,11.59 TP6.TP
D13
  Top 0.203: U$6.32 40.32,12.93 40.32,16.03 39.69,16.67 28.57,16.67 27.3,15.24 D2.A
D14  (via drill 0.38)
  Top 0.203: U$6.8 37.47,5.83 37.47,7.3 36.83,7.94 v36.83,9.05 | v33.34,11.11 33.81,11.59 33.81,13.81 34.92,14.92 RX1.C
  Bottom 0.203: v36.83,9.05 36.83,9.37 34.92,11.27 33.5,11.27 v33.34,11.11
D15  (via drill 0.38)
  Top 0.203: U$6.9 37.94,5.6 37.94,7.62 37.78,7.78 v37.78,8.73
  Bottom 0.203: v37.78,8.73 37.78,9.05 35.08,11.75 23.18,11.75 22.23,10.79 20.32,10.79 J1.3
D16  (via drill 0.38)
  Top 0.203: U$6.10 38.42,5.37 v38.42,8.1
  Bottom 0.203: v38.42,8.1 38.42,9.05 35.24,12.22 23.18,12.22 22.07,13.33 20.32,13.33 J1.4
D17  (via drill 0.38)
  Top 0.203: U$6.11 38.89,5.14 38.89,7.3 v39.05,7.46 | v23.18,13.33 17.78,13.33 J1.1
  Bottom 0.203: v39.05,7.46 39.05,9.05 35.4,12.7 23.81,12.7 v23.18,13.33
D18  (via drill 0.38)
  Top 0.203: v40.32,9.37 40.48,9.37 41.59,8.26 42.55,8.26 42.55,8.24 U$6.22 | v33.66,14.76 33.34,15.08 32.38,15.08 TX1.C
  Bottom 0.203: v40.32,9.37 40.01,9.37 35.72,13.65 34.77,13.65 v33.66,14.76
FB  (via drill 0.38)
  Top 0.305: R10.2 v5.56,4.13 5.67,4.24 U2.10 | R11.1 v10.95,8.89
  Bottom 0.305: v10.95,8.89 10.95,4.76 10.32,4.13 v5.56,4.13
GND  (via drill 0.38)
  Top 0.203: U2.12 7.37,5.17 v7.14,5.4 | U2.13 6.91,8.17 v7.14,7.94 | 7.64,7.17 arc90 U2.15
  Top 0.305: U2.4 7.64,7.17
  other vias: 7.14,6.67 23.02,5.24 35.72,8.73 28.89,9.05 38.73,13.33 43.97,9.37 25.88,4.76 31.75,1.27 14.61,15.88 62.23,16.51 57.15,16.51 62.23,1.27 45.4,0.95 24.13,1.27 20.32,1.27 19.05,5.08 27.3,10.16
  pour Top: 0,0 63.5,0 63.5,17.15 0,17.15
  pour Bottom: 0,0 63.5,0 63.5,17.15 0,17.15
  pour Route15: 0,17.15 0,0 63.5,0 63.5,17.15
GND1
  Top 0.203: R10.1 1.44,4.13 | R4.1 2.7,5.4
  Top 0.305: 1.44,4.13 R4.1 | U2.9 5.06,6.17 4.76,5.87 4.76,5.4 4.29,4.92 3.17,4.92 2.7,5.4
N$1
  Top 0.406: IC1.3 51.44,10.79 52.07,11.43 52.07,14.97 R1.1
N$2
  Top 0.305: D4.C R9.2
N$3
  Top 0.203: U$6.16 41.59,4.95 41.59,3.49 42.04,3.04 Y2.3
N$4
  Top 0.406: C6.2 C7.2 C8.2 49.16,6.98 IC1.6
N$5  (via drill 0.38)
  Top 0.305: U2.3 9.21,6.67 v9.84,7.3 | v3.97,10.48 L1.P$1
  Bottom 0.305: v9.84,7.3 10,7.46 10,9.84 9.37,10.48 v3.97,10.48
N$6
  Top 0.406: IC1.11 57.15,6.98 58.16,7.99 C3.1
N$7
  Top 0.406: IC1.10 57.15,5.71 57.78,6.35 C4.2
N$8
  Top 0.406: IC1.9 57.15,4.45 57.78,5.08 58.69,5.08 C4.1
N$9
  Top 0.203: 10.95,5.4 C15.1
  Top 0.305: U2.1 9.41,5.67 9.68,5.4 10.95,5.4
N$11
  Top 0.203: U1.5 10.81,14.3 | R5.1
  Top 0.305: U1.5 11.74,14.29 12.7,15.24 R5.1
N$12
  Top 0.406: IC1.16 57.52,13.33 C2.1
N$14
  Top 0.203: U1.1 7.15,14.29
  Top 0.305: 7.15,14.29 6.51,14.92 4.75,14.92 R9.1
N$15
  Top 0.406: IC1.15 57.52,12.06 C1.2
N$17  (via drill 0.38)
  Top 0.203: U$1.1 27.62,4.6 v26.51,3.49
  Bottom 0.203: v26.51,3.49 26.19,3.49 24.92,4.76 Q1.1
N$18
  Top 0.203: U$6.17 42.01,5.24 43.18,5.24 Y2.1
N$19  (via drill 0.38)
  Top 0.203: U$1.2 27.78,3.33 v27.3,2.86
  Bottom 0.203: v27.3,2.86 26.19,2.86 23.97,5.08 23.97,7.14 Q1.2
N$20  (via drill 0.38)
  Top 0.203: U$1.3 v30.96,2.06
  Bottom 0.203: v30.96,2.06 30.96,2.76 BAT1.PWR@1
N$22
  Top 0.203: U$6.4 34.84,6.03 30.32,6.03 30,6.35 29.84,6.35 29.84,6.56 R6.2
N$23
  Top 0.203: U$6.3 34.76,6.67 33.97,6.67 33.81,6.83 R2.2
N$24
  Top 0.203: U$6.6 35.46,5.24 27.3,5.24 24.92,2.86 19.84,2.86 17.78,4.92 17.78,6.35 17.14,6.98 14.76,6.98 14.13,7.62 C19.1
N$25
  Top 0.203: R2.1 31.22,6.88 30.48,7.62 27.15,7.62 26.67,7.14 23.02,7.14 21.57,5.7 X2.D-
N$26
  Top 0.203: R6.1 27.15,6.83 26.99,6.67 23.18,6.67 22.23,5.71 X2.D+ 22.23,3.81
N$28
  Top 0.203: TX1.A 31.45,11.98 RP1.6
N$29
  Top 0.203: RX1.A 34.92,11.75 33.66,10.48 32.47,10.48 RP1.5
N$30
  Top 0.203: PWR1.C 30.64,12.12 RP1.7
N$31
  Top 0.203: D2.C 29.52,10.7 RP1.8
REF
  Top 0.203: U$6.42 34.81,10.32 34.61,10.32 34.13,9.84 28.57,9.84 28.26,9.53 17.78,9.53 17.14,10.16 15.24,10.16 14.61,9.53 C22.1
RFID_CLK  (via drill 0.38)
  Top 0.203: v43.5,10.95 44.45,10.95 44.77,10.64 44.77,7.94 43.5,6.67 42.71,6.67 U$6.20
  Top 0.254: v48.26,11.43 48.9,12.06 IC1.2
  Bottom 0.203: v48.26,11.43 47.78,10.95 v43.5,10.95
  Bottom 0.254: JP9.1 59.69,11.43 v48.26,11.43
RFID_DATA  (via drill 0.38)
  Top 0.203: U$6.21 42.94,7.14 43.34,7.14 44.13,7.94 v44.13,8.41
  Top 0.254: v53.34,9.53 IC1.13
  Bottom 0.203: v53.34,9.53 45.24,9.53 v44.13,8.41
  Bottom 0.254: JP8.1 61.59,9.53 v53.34,9.53
RFID_EN  (via drill 0.38)
  Top 0.203: U$6.25 42.66,10.32 v44.13,10.32
  Top 0.254: v52.7,10.64 52.86,10.79 IC1.14
  Bottom 0.203: v44.13,10.32 52.39,10.32 v52.7,10.64
  Bottom 0.254: JP7.1 61.59,10.79 52.86,10.79 v52.7,10.64
RST  (via drill 0.38)
  Top 0.203: J1.5 21.86,11.79 S1.P$2 | U$6.13 39.37,5.05 39.37,6.51 v39.69,6.83 | v24.77,13.33 S1.P$2 | R7.2 25.61,10.94 S1.P$2
  Bottom 0.203: v39.69,6.83 39.69,9.05 35.56,13.18 24.92,13.18 v24.77,13.33
SCL  (via drill 0.38)
  Top 0.203: U$1.6 35.88,2.06 v36.35,2.54 R8.2 | U$6.18 40.32,7.64 v40.32,8.41
  Bottom 0.203: v36.35,2.54 39.37,2.54 TP14.TP 40.32,3.49 v40.32,8.41
SDA  (via drill 0.38)
  Top 0.203: R12.2 36.35,1.27 35.88,0.79 U$1.5 32.86,0.79 32.54,1.11 v32.54,1.91 | U$6.19 41.12,7.55 v41.12,7.78
  Bottom 0.203: v41.12,7.78 41.27,7.62 TP13.TP v32.54,1.91
UVLO
  Top 0.203: 3.35,6.67 C14.2 | 1.43,5.41 R4.2
  Top 0.305: U2.7 4.47,7.17 3.97,6.67 3.35,6.67 | C14.2 R3.1 1.43,5.41
VBATT
  Top 0.305: LIPO.1 3.17,13.33 C12.1 5.38,12.38 U1.3
  Bottom 0.305: S2.1 1.91,3.17 LIPO.1
VBUS  (via drill 0.38)
  Top 0.203: 9.55,13.3 v9.53,13.33 | U$6.7 36.99,6.06 36.99,6.83 35.88,7.94 35.33,7.94 U$6.2 | 15.94,9.21 D3.2 | X2.VBUS 20.82,3.81
  Top 0.305: U1.4 9.55,13.3 | D3.2 v15.88,7.94 | 20.82,3.81 v20,3.81 | U$6.2 34.53,7.14 34.13,7.14 33.5,7.78 v32.07,7.78 | v9.53,13.33 8.89,13.33 8.57,13.65 8.57,14.92 8.88,15.22 C11.1 D4.A
  Bottom 0.305: v9.53,13.33 12.38,13.33 15.88,9.84 v15.88,7.94 15.88,5.08 17.14,3.81 v20,3.81 20,6.67 22.54,9.21 25.72,9.21 26.83,8.1 31.75,8.1 v32.07,7.78
VCC  (via drill 0.38)
  Top 0.203: 13.19,4.43 C17.A 13.34,5.08 | U$6.34 | 10.94,6.67 R11.2 | R7.1 19.37,10.48 v19.05,10.16 | PWR1.A 29.15,15.02 v28.57,14.45
  Top 0.305: U2.2 9.82,6.17 10.32,6.67 10.94,6.67 | C13.1 D3.1 14.47,5.71 C17.A v13.34,3.33 | C16.1 C21.1 15.46,14.61 J1.2 | RP1.3 RP1.4 v33.66,9.05 34.46,9.05 U$6.44 | R12.1 R8.1 39.59,3.44 39.37,3.65 | 39.37,3.65 37.62,3.65 36.67,4.6 U$1.8 v32.38,4.6 | 39.37,3.65 39.85,3.65 40.48,4.29 40.48,4.65 U$6.14 | U$6.34 39.85,10.95 v39.85,10.64 40.16,10.64 41.75,9.05 42.09,9.05 U$6.24 | 38.1,12.7 U$6.34 | 13.34,5.08 11.76,6.65 R11.2
  Top 0.406: C5.1 57.78,3.81 57.15,3.17 53.34,3.17 52.07,4.45 52.07,5.71 | 52.07,5.71 v52.7,6.35 52.7,8.89 52.07,9.53 IC1.4 | IC1.7 52.07,5.71
  Route2 0.203: v39.85,10.64 40.01,10.79
  pour Route2: 0,17.15 63.5,17.15 63.5,0 0,0

### Text on the board
tPlace: D13 | PWR | TX | RX